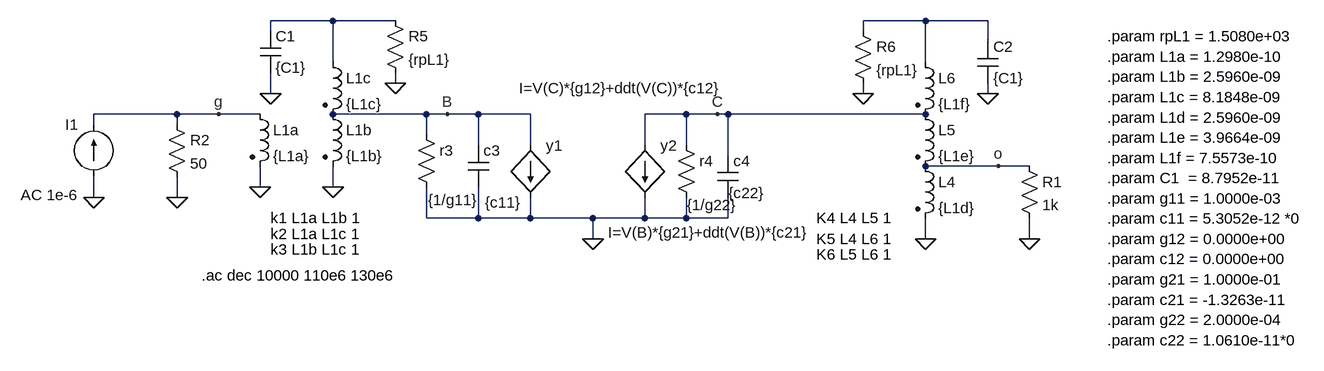
[diagram p0: schematic rf.asc]
rf.asc, the LTspice schematic file:
Version 4
SHEET 1 880 680
WIRE -1136 -224 -1232 -224
WIRE -1040 -224 -1136 -224
WIRE -224 -224 -320 -224
WIRE -128 -224 -224 -224
WIRE -1232 -208 -1232 -224
WIRE -320 -208 -320 -224
WIRE -128 -192 -128 -224
WIRE -1136 -160 -1136 -224
WIRE -224 -160 -224 -224
WIRE -1040 -128 -1040 -144
WIRE -1232 -112 -1232 -144
WIRE -320 -112 -320 -128
WIRE -128 -112 -128 -128
WIRE -1376 -80 -1504 -80
WIRE -1312 -80 -1376 -80
WIRE -1248 -80 -1312 -80
WIRE -992 -80 -1136 -80
WIRE -960 -80 -992 -80
WIRE -912 -80 -960 -80
WIRE -832 -80 -912 -80
WIRE -592 -80 -656 -80
WIRE -544 -80 -592 -80
WIRE -528 -80 -544 -80
WIRE -224 -80 -528 -80
WIRE -1504 -64 -1504 -80
WIRE -1376 -64 -1376 -80
WIRE -992 -48 -992 -80
WIRE -912 -32 -912 -80
WIRE -832 -32 -832 -80
WIRE -656 -32 -656 -80
WIRE -592 -32 -592 -80
WIRE -528 -16 -528 -80
WIRE -112 0 -224 0
WIRE -64 0 -112 0
WIRE -1248 32 -1248 0
WIRE -1136 32 -1136 0
WIRE -1504 48 -1504 16
WIRE -1376 48 -1376 16
WIRE -992 80 -992 32
WIRE -912 80 -912 32
WIRE -912 80 -992 80
WIRE -832 80 -832 48
WIRE -832 80 -912 80
WIRE -736 80 -832 80
WIRE -656 80 -656 48
WIRE -656 80 -736 80
WIRE -592 80 -592 48
WIRE -592 80 -656 80
WIRE -528 80 -528 48
WIRE -528 80 -592 80
WIRE -736 112 -736 80
WIRE -224 112 -224 80
WIRE -64 112 -64 80
FLAG -1504 48 0
FLAG -1248 32 0
FLAG -1136 32 0
FLAG -224 112 0
FLAG -1232 -112 0
FLAG -128 -112 0
FLAG -64 112 0
FLAG -1376 48 0
FLAG -736 112 0
FLAG -544 -80 C
FLAG -960 -80 B
FLAG -1312 -80 g
FLAG -112 0 o
FLAG -1040 -128 0
FLAG -320 -112 0
SYMBOL ind2 -1264 -96 R0
SYMATTR InstName L1a
SYMATTR Value {L1a}
SYMATTR Type ind
SYMBOL ind2 -1152 -96 R0
SYMATTR InstName L1b
SYMATTR Value {L1b}
SYMATTR Type ind
SYMBOL ind2 -1152 -176 R0
SYMATTR InstName L1c
SYMATTR Value {L1c}
SYMATTR Type ind
SYMBOL ind2 -240 -16 R0
SYMATTR InstName L4
SYMATTR Value {L1d}
SYMATTR Type ind
SYMBOL ind2 -240 -96 R0
SYMATTR InstName L5
SYMATTR Value {L1e}
SYMATTR Type ind
SYMBOL ind2 -240 -176 R0
SYMATTR InstName L6
SYMATTR Value {L1f}
SYMATTR Type ind
SYMBOL cap -1248 -208 R0
SYMATTR InstName C1
SYMATTR Value {C1}
SYMBOL cap -144 -192 R0
SYMATTR InstName C2
SYMATTR Value {C1}
SYMBOL res -80 -16 R0
SYMATTR InstName R1
SYMATTR Value 1k
SYMBOL res -1392 -80 R0
SYMATTR InstName R2
SYMATTR Value 50
SYMBOL current -1504 16 R180
WINDOW 0 24 80 Left 2
WINDOW 3 24 0 Left 2
WINDOW 123 24 -28 Left 2
WINDOW 39 0 0 Left 2
SYMATTR InstName I1
SYMATTR Value ""
SYMATTR Value2 AC 1e-6
SYMBOL res -1008 -64 R0
WINDOW 3 18 116 Left 2
SYMATTR Value {1/g11}
SYMATTR InstName r3
SYMBOL cap -928 -32 R0
WINDOW 3 26 88 Left 2
SYMATTR Value {c11}
SYMATTR InstName c3
SYMBOL res -608 -48 R0
WINDOW 3 17 108 Left 2
SYMATTR Value {1/g22}
SYMATTR InstName r4
SYMBOL cap -544 -16 R0
WINDOW 3 17 57 Left 2
SYMATTR Value {c22}
SYMATTR InstName c4
SYMATTR SpiceLine Rser=0
SYMBOL bi -832 -32 R0
WINDOW 3 -18 -88 Left 2
SYMATTR Value I=V(C)*{g12}+ddt(V(C))*{c12}
SYMATTR InstName y1
SYMBOL bi -656 -32 R0
WINDOW 3 -57 134 Left 2
SYMATTR Value I=V(B)*{g21}+ddt(V(B))*{c21}
SYMATTR InstName y2
SYMBOL res -1056 -240 R0
SYMATTR InstName R5
SYMATTR Value {rpL1}
SYMBOL res -336 -224 R0
SYMATTR InstName R6
SYMATTR Value {rpL1}
TEXT -1338 168 Left 2 !.ac dec 10000 110e6 130e6
TEXT -1232 80 Left 2 !k1 L1a L1b 1
TEXT -1232 104 Left 2 !k2 L1a L1c 1
TEXT -1232 128 Left 2 !k3 L1b L1c 1
TEXT -392 80 Left 2 !K4 L4 L5 1
TEXT -392 112 Left 2 !K5 L4 L6 1
TEXT -392 136 Left 2 !K6 L5 L6 1
TEXT 56 -200 Left 2 !.param rpL1 = 1.5080e+03 \n.param L1a = 1.2980e-10 \n.param L1b = 2.5960e-09 \n.param L1c = 8.1848e-09 \n.param L1d = 2.5960e-09 \n.param L1e = 3.9664e-09 \n.param L1f = 7.5573e-10 \n.param C1  = 8.7952e-11 \n.param g11 = 1.0000e-03 \n.param c11 = 5.3052e-12 *0\n.param g12 = 0.0000e+00 \n.param c12 = 0.0000e+00 \n.param g21 = 1.0000e-01 \n.param c21 = -1.3263e-11 \n.param g22 = 2.0000e-04 \n.param c22 = 1.0610e-11*0

The netlist it stands for:
* rf.asc
L1a g 0 {L1a}
L1b B 0 {L1b}
L1c N001 B {L1c}
L4 o 0 {L1d}
L5 C o {L1e}
L6 N002 C {L1f}
C1 N001 0 {C1}
C2 N002 0 {C1}
R1 o 0 1k
R2 g 0 50
I1 0 g AC 1e-6
r3 B 0 {1/g11}
c3 B 0 {c11}
r4 C 0 {1/g22}
c4 C 0 {c22} Rser=0
B§y1 B 0 I=V(C)*{g12}+ddt(V(C))*{c12}
B§y2 C 0 I=V(B)*{g21}+ddt(V(B))*{c21}
R5 N001 0 {rpL1}
R6 N002 0 {rpL1}
.ac dec 10000 110e6 130e6
k1 L1a L1b 1
k2 L1a L1c 1
k3 L1b L1c 1
K4 L4 L5 1
K5 L4 L6 1
K6 L5 L6 1
.param rpL1 = 1.5080e+03
.param L1a = 1.2980e-10
.param L1b = 2.5960e-09
.param L1c = 8.1848e-09
.param L1d = 2.5960e-09
.param L1e = 3.9664e-09
.param L1f = 7.5573e-10
.param C1  = 8.7952e-11
.param g11 = 1.0000e-03
.param c11 = 5.3052e-12 *0
.param g12 = 0.0000e+00
.param c12 = 0.0000e+00
.param g21 = 1.0000e-01
.param c21 = -1.3263e-11
.param g22 = 2.0000e-04
.param c22 = 1.0610e-11*0
.backanno
.end